# EAGLE design oh_oh_nose_0001 (EAGLE 5.06)
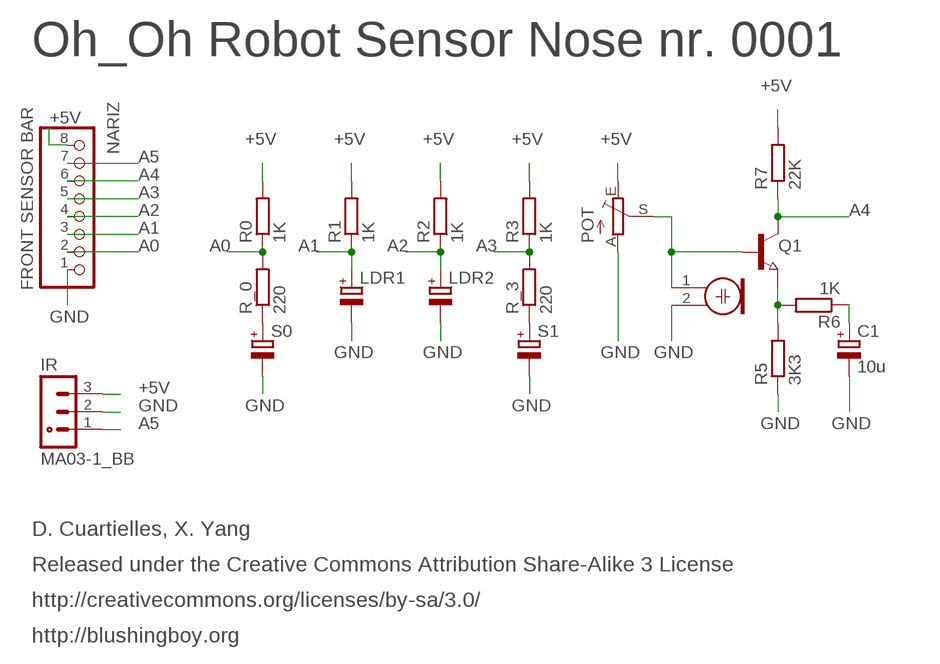
[diagram p0: schematic, sheet 1]

## Parts
C1  10u  C-POLE2,5-6  [E2,5-6]
IR  MA03-1_BB  [MA03-1_BB]
LDR1  C-POLE2,5-6  [E2,5-6]
LDR2  C-POLE2,5-6  [E2,5-6]
M1  ELECTRET_MICROPHON-F6050AP  [F6050AP]
NARIZ  FRONT SENSOR BAR  PINHD-1X8  [1X08]
POT  TRIM_EU-CT6  [CT6]
Q1  NPN-TRANSISTOR_SOT23  [SOT23]
R0  1K  RM1206  [M1206]
R1  1K  RM1206  [M1206]
R2  1K  RM1206  [M1206]
R3  1K  RM1206  [M1206]
R5  3K3  RM1206  [M1206]
R6  1K  RM1206  [M1206]
R7  22K  RM1206  [M1206]
R_0  220  RM1206  [M1206]
R_3  220  RM1206  [M1206]
S0  C-POLE2,5-6  [E2,5-6]
S1  C-POLE2,5-6  [E2,5-6]

## Nets
+5V [power]: IR.3 NARIZ.8 POT.E R0.2 R1.2 R2.2 R3.2 R7.2
A0: NARIZ.2 R0.1 R_0.2
A1: LDR1.+ NARIZ.3 R1.1
A2: LDR2.+ NARIZ.4 R2.1
A3: NARIZ.5 R3.1 R_3.2
A4: NARIZ.6 Q1.3(C) R7.1
A5: IR.1 NARIZ.7
GND: C1.- IR.2 LDR1.- LDR2.- M1.2 NARIZ.1 POT.A R5.1 S0.- S1.-
N$1: Q1.2(E) R5.2 R6.2
N$2: C1.+ R6.1
N$3: R_0.1 S0.+
N$4: R_3.1 S1.+
N$6: M1.1 POT.S Q1.1(B)

## Notes on the sheet
- Oh_Oh Robot Sensor Nose nr. 0001
- D. Cuartielles, X. Yang
- Released under the Creative Commons Attribution Share-Alike 3 License
- http://creativecommons.org/licenses/by-sa/3.0/
- http://blushingboy.org

## Library data of the parts
C1 LDR1 LDR2 S0 S1 = blushingboy_experimental:C-POL
IR = blushingboy_experimental:MA03-1_BB
M1 = microphon:ELECTRET_MICROPHON-: Electret Condenser Microphone
NARIZ = pinhead:PINHD-1X8: PIN HEADER
POT = pot:TRIM_EU-: POTENTIOMETER
Q1 = semicon-smd-ipc:NPN-TRANSISTOR_: NPN TRANSISTOR
R0 R1-R3 R5-R7 R_0 R_3 = blushingboy_experimental:R

## Net classes
1 power: width 0.61 mm

## Board
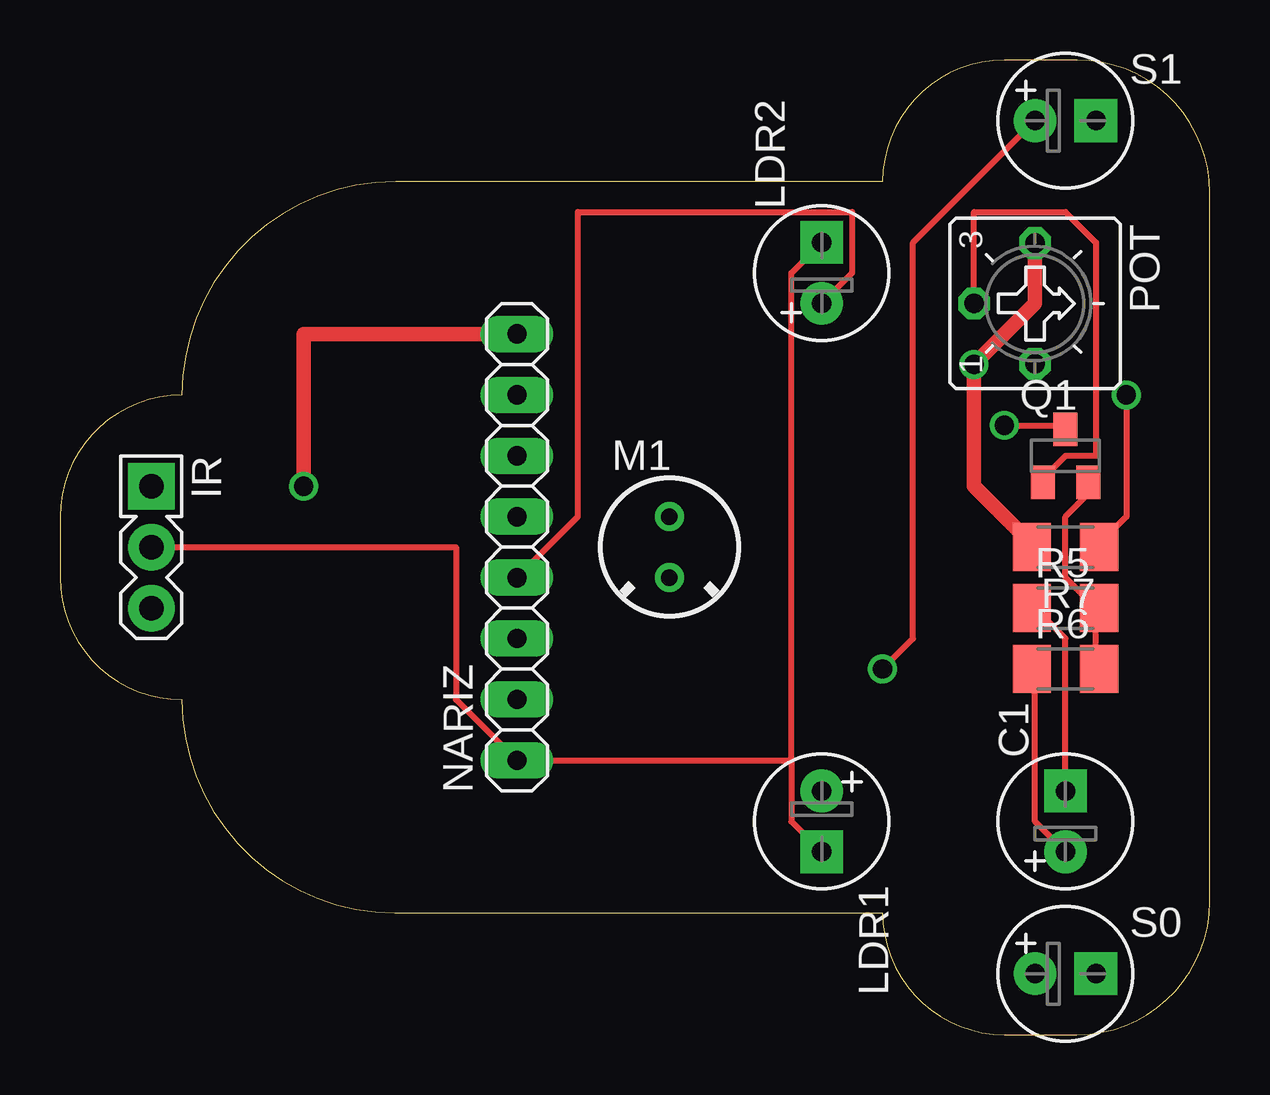
[diagram p1: board, top side]
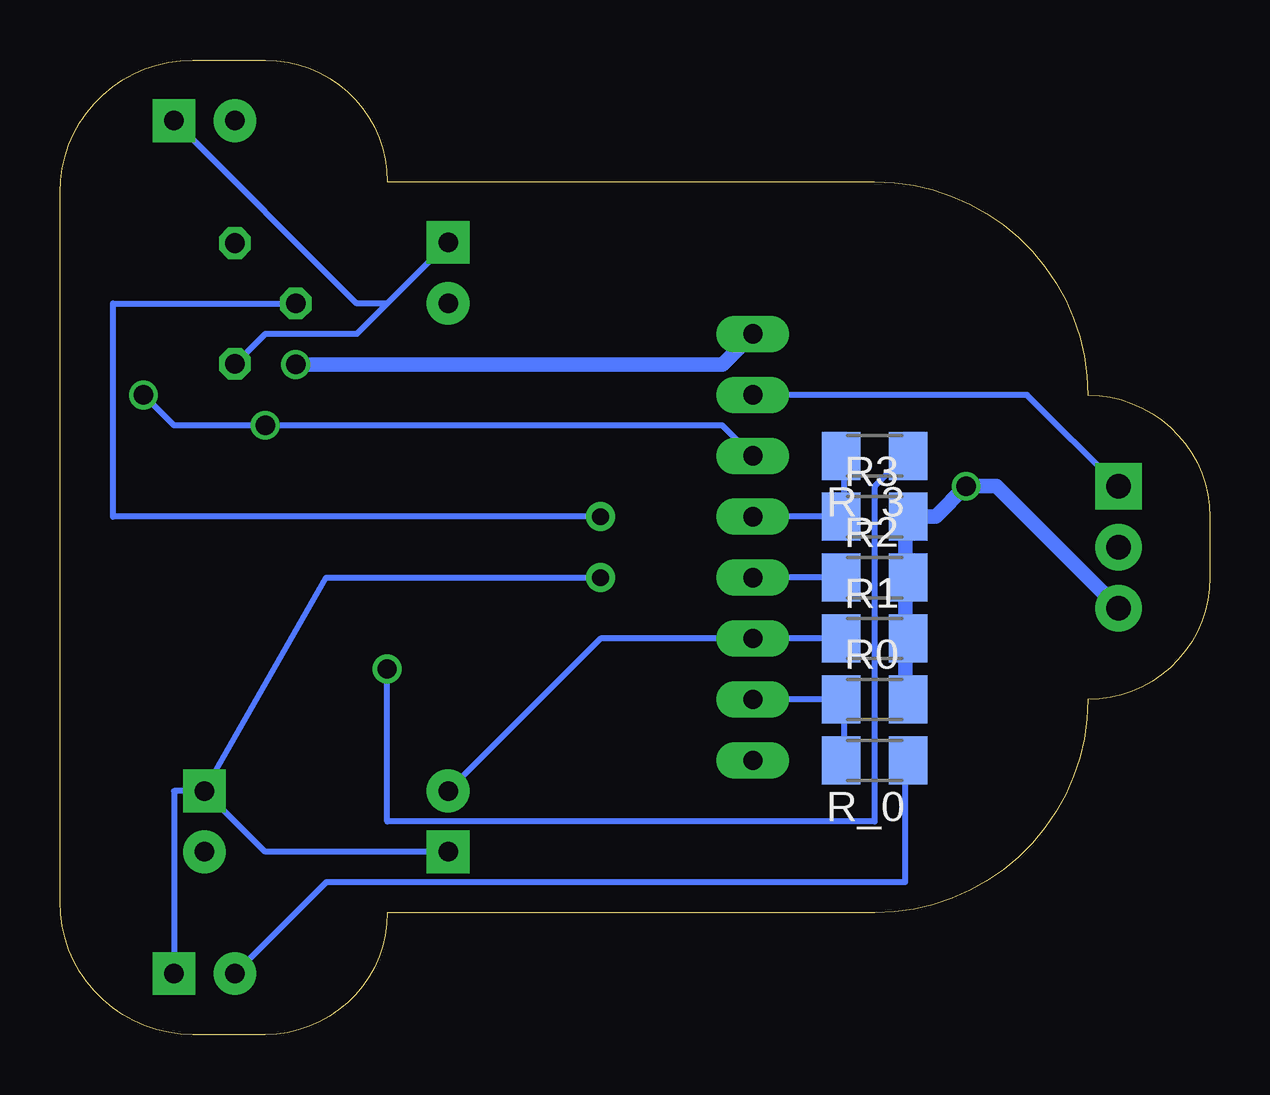
[diagram p2: board, bottom side, seen from below]

Size 47.93 x 40.63 mm. Coordinates in mm from the lower left corner, seen from the top.
Outline: 5.08,13.97 arc90 13.97,5.08 34.29,5.08 arc90 39.37,0 42.39,0 arc90 47.93,5.54 47.93,35.1 arc90 42.4,40.63 39.36,40.63 arc90 34.29,35.56 13.98,35.56 arc90 5.08,26.66 arc90 0,21.58 0,19.05 arc90 5.08,13.97
Copper layers (1*16): Top 0.035mm / dielectric 1.5mm / Bottom 0.035mm
Design rules "default": minimum track width 10mil, minimum drill 24mil, track to track 8mil, track to pad 8mil, pad to pad 8mil, via to via 8mil, smd to smd 8mil, copper to edge 40mil, drill to drill 8mil, minimum pad ring 10mil, minimum via ring 8mil, stop-mask expansion 4mil, vias tented up to drill 0mil, thermal gap 10mil

### Footprints (pad centres in the part's own frame; a part is rotated, then mirrored left to right if it is on the bottom)
E2,5-6 = drill 0.813 pad 1.778 round: + 0,0 | drill 0.813 pad 1.778 square: - 2.54,0
MA03-1_BB = drill 1.016 pad 1.93 square: 1 -2.54,0 | drill 1.016 pad 1.93 round: 2 0,0; 3 2.54,0
F6050AP = drill 0.7 pad 1.2 round: 1 0,1.27; 2 0,-1.27
1X08 = drill 0.8 pad 1.524 long: 1 -8.89,0; 2 -6.35,0; 3 -3.81,0; 4 -1.27,0; 5 1.27,0; 6 3.81,0; 7 6.35,0; 8 8.89,0
CT6 = drill 0.813 octagon: A 2.515,0; E -2.515,0; S 0,-2.54
SOT23 = smd 1 x 1.4: 1 -0.95,-1.1; 2 0.95,-1.1; 3 0,1.1
M1206 = smd 1.6 x 2: 1 -0.13,0; 2 2.67,0

### Placement (x,y rotation side)
C1  41.91,7.62 90 top
IR  3.81,20.32 270 top
LDR1  31.75,10.16 270 top
LDR2  31.75,30.48 90 top
M1  25.4,20.32 0 top
NARIZ  19.05,20.32 90 top
POT  40.64,30.48 270 top
Q1  41.91,24.13 0 top
R0  15.24,13.97 0 bottom
R1  15.24,16.51 0 bottom
R2  15.24,19.05 0 bottom
R3  15.24,21.59 0 bottom
R5  40.64,17.78 0 top
R6  40.64,15.24 0 top
R7  43.18,20.32 180 top
R_0  12.7,11.43 180 bottom
R_3  12.7,24.13 180 bottom
S0  40.64,2.54 0 top
S1  40.64,38.1 0 top

### Tracks (layer width: path | path; a pad name or v marks a point on that pad's centre or on a via)
+5V  (via drill 0.8)
  Top 0.61: R7.2 40.64,20.32 38.1,22.86 v38.1,27.94 40.64,30.48 POT.E 40.64,33.02 | NARIZ.8 10.16,29.21 v10.16,22.86
  Bottom 0.61: 12.7,16.51 12.7,13.97 R0.2 | 12.7,19.05 12.7,21.59 R3.2 11.43,21.59 v10.16,22.86 8.89,22.86 IR.3 | 12.7,19.05 12.7,16.51 | 12.7,16.51 R1.2 | 12.7,19.05 R2.2 | v38.1,27.94 20.32,27.94 NARIZ.8
A0
  Bottom 0.254: R_0.2 15.24,11.43 15.24,13.97 R0.1 NARIZ.2
A1
  Bottom 0.254: 15.24,16.51 R1.1 NARIZ.3 25.4,16.51 LDR1.+
A2
  Top 0.254: LDR2.+ 33.02,31.75 33.02,34.29 21.59,34.29 21.59,21.59 NARIZ.4
  Bottom 0.254: NARIZ.4 R2.1 15.24,19.05
A3
  Bottom 0.254: R_3.2 15.24,24.13 15.24,21.59 R3.1 NARIZ.5
A4  (via drill 0.8)
  Top 0.254: v39.37,25.4 41.91,25.4 Q1.3 | v44.45,26.67 44.45,21.59 43.18,20.32 R7.1
  Bottom 0.254: NARIZ.6 20.32,25.4 v39.37,25.4 43.18,25.4 v44.45,26.67
A5
  Bottom 0.254: NARIZ.7 7.62,26.67 IR.1
GND
  Top 0.254: C1.- 41.91,16.51 40.64,17.78 R5.1 | 30.48,11.43 NARIZ.1 16.51,13.97 16.51,20.32 IR.2 | 30.48,11.43 30.48,8.89 LDR1.- | LDR2.- 30.48,31.75 30.48,11.43
  Bottom 0.254: M1.2 36.83,19.05 C1.- | S0.- 43.18,10.16 C1.- | LDR2.- 34.29,30.48 | 34.29,30.48 35.56,29.21 39.37,29.21 40.64,27.94 POT.A | S1.- 35.56,30.48 34.29,30.48 | C1.- 39.37,7.62 LDR1.-
N$1
  Top 0.254: 43.18,17.78 41.91,19.05 41.91,21.59 43.18,22.86 Q1.2 | 43.18,17.78 43.18,15.24 R6.2 | 43.18,17.78 R5.2
N$2
  Top 0.254: C1.+ 40.64,8.89 40.64,15.24 R6.1
N$3
  Bottom 0.254: S0.+ 36.83,6.35 12.7,6.35 12.7,11.43 R_0.1
N$4  (via drill 0.8)
  Top 0.254: v34.29,15.24 35.56,16.51 35.56,33.02 S1.+
  Bottom 0.254: v34.29,15.24 34.29,8.89 13.97,8.89 13.97,22.86 12.7,24.13 R_3.1
N$6
  Top 0.254: POT.S 38.1,34.29 41.91,34.29 43.18,33.02 43.18,24.13 41.91,24.13 40.64,22.86 Q1.1
  Bottom 0.254: M1.1 45.72,21.59 45.72,30.48 POT.S

### Text on the board
theSilk: O | O